# Altium schematic sheet PD Controller Sink.SchDoc
size 297 x 209 mm; CompanyName: Sainsbury Wellcome Centre; Organization: FabLab; Address1: Sainsbury Wellcome Centre; Address2: 25 Howland Street; Address3: London; Address4: W1T 4JG; DocumentNumber: 5; SheetNumber: 5; SheetTotal: 14; swcgroup: FabLab; Org: Sainsbury Wellcome Centre; Add1: 25 Howland Street; Add2: London; Add3: W1T 4JG; WebAddress: www.sainsburywellcome.org; SheetSize: A4; SheetName: PD Controller Sink
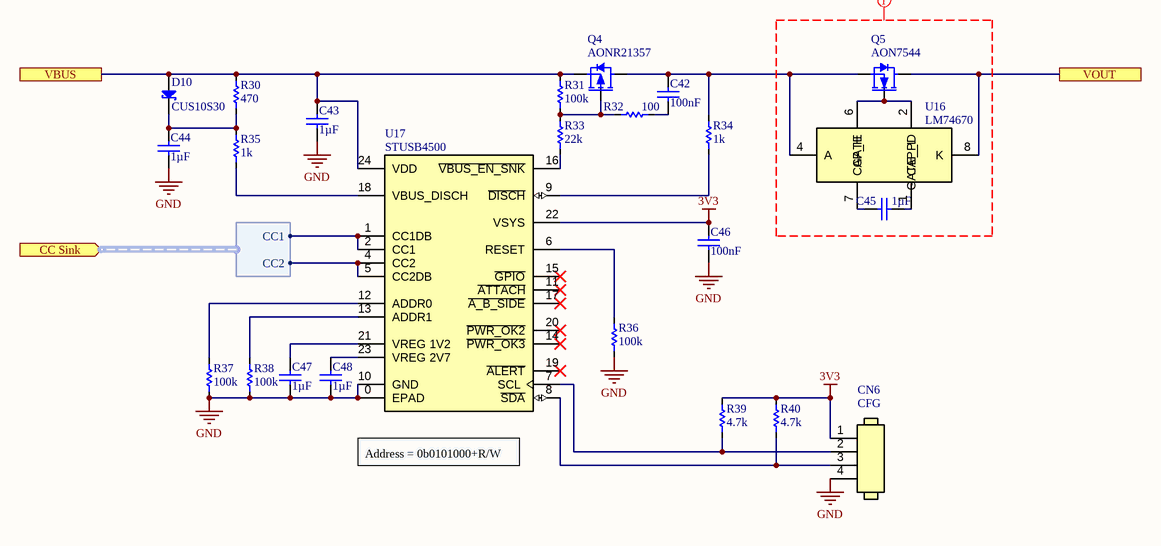
[diagram p0: PD Controller Sink.SchDoc]

## Parts
C42  value 100nF  [CAP_CHIP_0603]  (hidden comment: C0603-100nF-50V)
C43  value 1µF  [CAP_CHIP_0603]  (hidden comment: C0603-1uF-50V)
C44  value 1µF  [CAP_CHIP_0603]  (hidden comment: C0603-1uF-50V)
C45  value 1µF  [CAP_CHIP_0603]  (hidden comment: C0603-1uF-50V)
C46  value 100nF  [CAP_CHIP_0603]  (hidden comment: C0603-100nF-50V)
C47  value 1µF  [CAP_CHIP_0603]  (hidden comment: C0603-1uF-50V)
C48  value 1µF  [CAP_CHIP_0603]  (hidden comment: C0603-1uF-50V)
CN6  CFG  [MOLEX_1.25_4P]
D10  CUS10S30  [SOD323]
Q4  AONR21357  [DFN-8-MOS]
Q5  AON7544  [DFN-8-MOS]
R30  value 470  [RES_CHIP_0603]  (hidden comment: R0603-470R)
R31  value 100k  [RES_CHIP_0603]  (hidden comment: R0603-100K)
R32  value 100  [RES_CHIP_0603]  (hidden comment: R0603-100R)
R33  value 22k  [RES_CHIP_0603]  (hidden comment: R0603-22K)
R34  value 1k  [RES_CHIP_0603]  (hidden comment: R0603-1K)
R35  value 1k  [RES_CHIP_0603]  (hidden comment: R0603-1K)
R36  value 100k  [RES_CHIP_0603]  (hidden comment: R0603-100K)
R37  value 100k  [RES_CHIP_0603]  (hidden comment: R0603-100K)
R38  value 100k  [RES_CHIP_0603]  (hidden comment: R0603-100K)
R39  value 4.7k  [RES_CHIP_0603]  (hidden comment: R0603-4K7)
R40  value 4.7k  [RES_CHIP_0603]  (hidden comment: R0603-4K7)
U16  LM74670  [VSSOP8_3X3_0.65E]
U17  STUSB4500  [QFN24]

## Ports
CC Sink (in, harness CC Sink), VBUS, VOUT

## Harnesses
CC Sink: CC1, CC2

## Nets
3V3: C46.2 CN6.1 R39.2 R40.2 U17.22(VSYS)
GND: C43.1 C44.1 C46.1 C47.1 C48.1 CN6.4 R36.1 R37.1 R38.1 U17.0(EPAD) U17.10(GND)
VBUS: C43.2 D10.2(A) Q4.1,2,3(S) R30.2 R31.2 U17.24(VDD) ; port VBUS
VOUT: Q5.5(D) U16.8(K) ; port VOUT
NetC42_1: C42.1 R32.2
NetC42_2: C42.2 Q4.5(D) Q5.1,2,3(S) R34.2 U16.4(A)
NetC44_2: C44.2 D10.1(C) R30.1 R35.2
NetC45_1: C45.1 U16.7(CAP_H)
NetC45_2: C45.2 U16.1(CAP_L)
NetC47_2: C47.2 U17.21(VREG_1V2)
NetC48_2: C48.2 U17.23(VREG_2V7)
NetCN6_2: CN6.2 R39.1 U17.7(SCL)
NetCN6_3: CN6.3 R40.1 U17.8(~{SDA})
NetQ4_4: Q4.4(G) R31.1 R32.1 R33.2
NetQ5_4: Q5.4(G) U16.2(GATE_PD) U16.6(GATE)
NetR33_1: R33.1 U17.16(~{VBUS_EN_SNK})
NetR34_1: R34.1 U17.9(~{DISCH})
NetR35_1: R35.1 U17.18(VBUS_DISCH)
NetR36_2: R36.2 U17.6(RESET)
NetR37_2: R37.2 U17.12(ADDR0)
NetR38_2: R38.2 U17.13(ADDR1)
NetU17_1: U17.1(CC1DB) U17.2(CC1) ; port CC Sink.CC1
NetU17_4: U17.4(CC2) U17.5(CC2DB) ; port CC Sink.CC2

Not connected (* = marked no-connect by the designer): U17 11(~{ATTACH})* 14(~{PWR_OK3})* 15(~{GPIO})* 17(~{A_B_SIDE})* 19(~{ALERT})* 20(~{PWR_OK2})*

## Layout directives
mark named Ideal Diode: (no net found under the mark)

## Notes on the sheet
- Address = 0b0101000+R/W
- FILE
- VARIANT
- DATE
- REVISION
- SHEET
- /
- PROJECT
- SIZE

## Library data of the parts
C42 C46 = CMP-611-0027-24: 0603 Multilayer Ceramic Capacitors MLCC; PartNumber: CC0603KRX7R9BB104; Tolerance: 10%; Pick&PlaceFootprint: C0603; Dielectric: X7R; Voltage Rating: 50V; Capacitor Type: Ceramic; RoHS: Yes; Mount: SMD; LCSC Part N.: C14663; Case/Package: 0603
C43-C45 C47 C48 = CMP-611-0033-11: 0603 Multilayer Ceramic Capacitors MLCC; PartNumber: CL10A105KB8NNNC; Pick&PlaceFootprint: C0603; Voltage Rating: 50V; Dielectric: X5R; Tolerance: 10%; Case/Package: 0603; LCSC Part N.: C15849; RoHS: Yes; Mount: SMD; Capacitor Type: Ceramic
CN6 = CMP-370-0030-7: Conn Shrouded Header (3 Sides) HDR 4 POS 1.25mm Solder ST Top Entry SMD PicoBlade™ T/R; PartNumber: 53398-0471; Current Rating: 1A; Number of Positions: 4; Gender: Male; LCSC Part N.: C17617036; Orientation: Vertical; Number of Rows: 1; Pitch: 1.25mm; Mounting Technology: Surface Mount
D10 = CMP-821-0013-3: Rectifier Diode, Schottky, 1 Phase, 1 Element, 1A, 30V V(RRM), Silicon; PartNumber: CUS10S30,H3F; Forward Voltage: 370mV; LCSC Part N.: C146335; Max Reverse Voltage: 30V; Mount: Surface Mount; Pick&PlaceFootprint: SOD323; Forward Current: 1A
Q4 = CMP-810-0004-1: 30V 30A 7.8mΩ@10V,20A 2.3V@250uA 1 PChannel DFN-8 MOSFETs; Drain-Source Voltage (Vds): -30V; RDS(ON): 8mR; Gate-Source Voltage (Vgs): 25V; Power Dissipation: 30W; Switching Time: 200ns; Drain Current (Id): -34A; Polarity: P Channel; Mount: Surface Mount; Pick&PlaceFootprint: DFN-8; PartNumber: AONR21357; LCSC Part N.: C431196
Q5 = CMP-810-0005-1: 30V 30A 5mΩ@10V,20A 2.2V@250uA 1 NChannel DFN-8 MOSFETs; Switching Time: 34.5ns; RDS(ON): 5mR; Power Dissipation: 1.4W; Gate-Source Voltage (Vgs): 20V; Mount: Surface Mount; Drain-Source Voltage (Vds): 30V; Drain Current (Id): 30A; LCSC Part N.: C315567; Pick&PlaceFootprint: DFN-8; Polarity: N Channel; PartNumber: AON7544
R30 = CMP-633-0020-24: 100mW Thick Film Resistors 75V ±100ppm/℃ ±1% 0603 Chip Resistor; PartNumber: 0603WAF4700T5E; Number of Resistors: 1; Pick&PlaceFootprint: R0603; LCSC Part N.: C23179; Case/Package: 0603; Power Rating: 100mW; Mount: Surface Mount; Voltage Rating: 75V; Tolerance: 1%
R31 R36-R38 = CMP-633-0000-28: 100mW Thick Film Resistors 75V ±100ppm/℃ ±1% 0603 Chip Resistor; PartNumber: 0603WAF1003T5E; Number of Resistors: 1; Pick&PlaceFootprint: R0603; LCSC Part N.: C25803; Mount: Surface Mount; Voltage Rating: 75V; Power Rating: 100mW; Case/Package: 0603; Tolerance: 1%
R32 = CMP-633-0094-12: 100mW Thick Film Resistors 75V ±100ppm/℃ ±1% 0603 Chip Resistor; PartNumber: 0603WAF1000T5E; Number of Resistors: 1; Pick&PlaceFootprint: R0603; Case/Package: 0603; Voltage Rating: 75V; Mount: Surface Mount; Tolerance: 1%; LCSC Part N.: C22775; Power Rating: 100mW
R33 = CMP-633-0099-12: 100mW Thick Film Resistors 75V ±100ppm/℃ ±1% 0603 Chip Resistor; PartNumber: 0603WAF2202T5E; Pick&PlaceFootprint: R0603; Number of Resistors: 1; LCSC Part N.: C31850; Mount: Surface Mount; Case/Package: 0603; Voltage Rating: 75V; Power Rating: 100mW; Tolerance: 1%
R34 R35 = CMP-633-0013-26: 100mW Thick Film Resistors 75V ±100ppm/℃ ±1% 0603 Chip Resistor; PartNumber: 0603WAF1001T5E; Pick&PlaceFootprint: R0603; Number of Resistors: 1; Voltage Rating: 75V; Case/Package: 0603; Tolerance: 1%; Mount: Surface Mount; LCSC Part N.: C21190; Power Rating: 100mW
R39 R40 = CMP-633-0024-26: 100mW Thick Film Resistors 75V ±100ppm/℃ ±1% 0603 Chip Resistor; PartNumber: 0603WAF4701T5E; Pick&PlaceFootprint: R0603; Number of Resistors: 1; Case/Package: 0603; Voltage Rating: 75V; Tolerance: 1%; Power Rating: 100mW; LCSC Part N.: C23162; Mount: Surface Mount
U16 = CMP-970-0064-2: OR Controller N-Channel Single Automotive 8-Pin VSSOP T/R; PartNumber: LM74670QDGKTQ1; Max Supply Voltage: 42V; Min Supply Voltage: 550mV; LCSC Part N.: C2653685
U17 = CMP-970-0029-9: Power Supply Support Circuit; PartNumber: STUSB4500QTR; LCSC Part N.: C2678061; Pick&PlaceFootprint: QFN24